# Altium schematic sheet Regulators.SchDoc: Power: Regulators
size A4; Engineer: Samer Kilani; DocumentNumber: 8; SheetNumber: 8; SheetTotal: 9
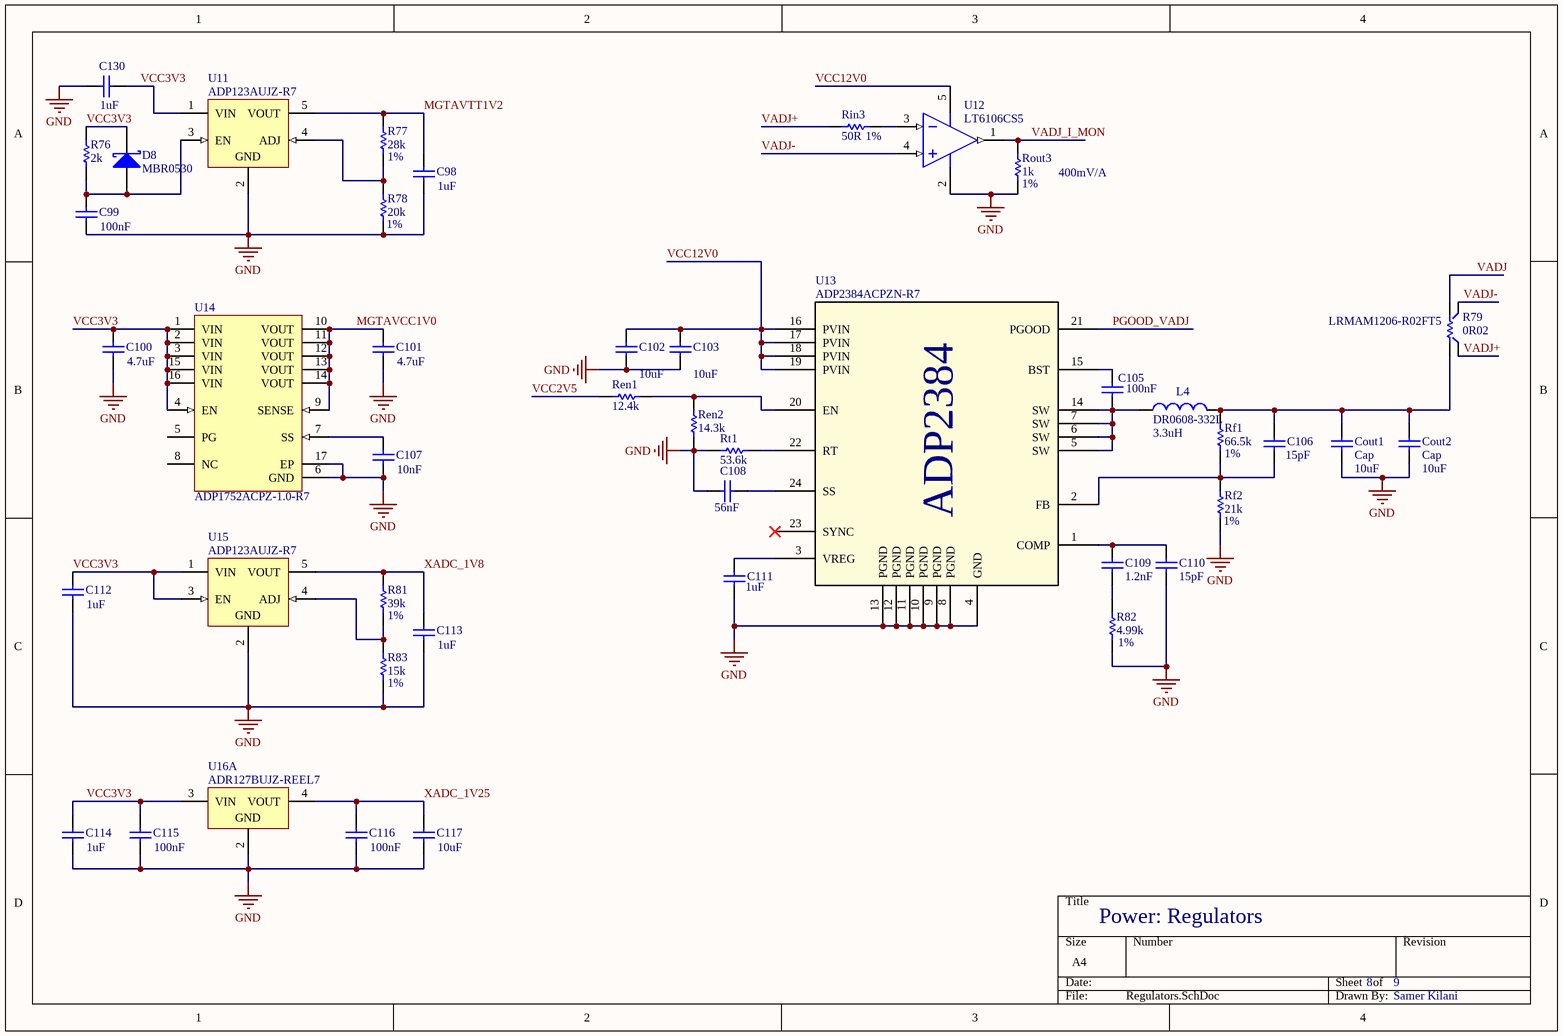
[diagram p0: Regulators.SchDoc]

## Parts
C98  value 1uF  [C0603]
C99  value 100nF  [C0402]
C100  value 4.7uF  [C0603]
C101  value 4.7uF  [C0603]
C102  value 10uF  [C0805]
C103  value 10uF  [C0805]
C105  value 100nF  [C0402]  (hidden comment: Cap)
C106  value 15pF  [C0402]
C107  value 10nF  [C0603]
C108  value 56nF  [C0402]
C109  value 1.2nF  [C0402]
C110  value 15pF  [C0402]
C111  value 1uF  [C0402]
C112  value 1uF  [C0603]
C113  value 1uF  [C0603]
C114  value 1uF  [C0603]
C115  value 100nF  [C0402]
C116  value 100nF  [C0402]
C117  value 10uF  [C0603]
C130  value 1uF  [C0603]
Cout1  Cap  value 10uF  [C0805]
Cout2  Cap  value 10uF  [C0805]
D8  MBR0530  [SOD-123]
L4  DR0608-332L  value 3.3uH  [DR0608]
R76  value 2k  [R0402]  (hidden comment: Res)
R77  value 28k  Tolerance: 1%  [R0402]  (hidden comment: Res)
R78  value 20k  Tolerance: 1%  [R0402]  (hidden comment: Res)
R79  LRMAM1206-R02FT5  value 0R02  [LRMA1206]  (net tie)
R81  value 39k  Tolerance: 1%  [R0603]  (hidden comment: Res)
R82  value 4.99k  Tolerance: 1%  [R0402]  (hidden comment: Res)
R83  value 15k  Tolerance: 1%  [R0603]  (hidden comment: Res)
Ren1  value 12.4k  [R0402]  (hidden comment: Res)
Ren2  value 14.3k  [R0402]  (hidden comment: Res)
Rf1  value 66.5k  Tolerance: 1%  [R0402]  (hidden comment: Res)
Rf2  value 21k  Tolerance: 1%  [R0402]  (hidden comment: Res)
Rin3  value 50R  Tolerance: 1%  [R0402]  (hidden comment: Res)
Rout3  value 1k  Tolerance: 1%  [R0402]  (hidden comment: Res)
Rt1  value 53.6k  [R0402]  (hidden comment: Res)
U11  ADP123AUJZ-R7  [ADI-UJ-5_N]
U12  LT6106CS5  [LT-S5-5-TSOT-23_N]
U13  ADP2384ACPZN-R7  [CP_24_12]
U14  ADP1752ACPZ-1.0-R7  [CP-16-4_N]
U15  ADP123AUJZ-R7  [ADI-UJ-5_N]
U16  ADR127BUJZ-REEL7  [ADI-UJ-6_N]  (part A of 2)

## Nets
GND: C98.2 C99.2 C100.2 C101.2 C102.2 C103.2 C107.2 C108.2 C110.2 C111.1 C112.2 C113.2 C114.2 C115.2 C116.2 C117.2 C130.1 Cout1.1 Cout2.1 R78.1 R82.1 R83.1 Ren2.1 Rf2.1 Rout3.1 Rt1.1 U11.2(GND) U12.2(V-) U13.4(GND) U13.8(PGND) U13.9(PGND) U13.10(PGND) U13.11(PGND) U13.12(PGND) U13.13(PGND) U14.6(GND) U14.17(EP) U15.2(GND) U16.2(GND)
MGTAVCC1V0: C101.1 U14.9(SENSE) U14.10(VOUT) U14.11(VOUT) U14.12(VOUT) U14.13(VOUT) U14.14(VOUT)
MGTAVTT1V2: C98.1 R77.2 U11.5(VOUT)
PGOOD_VADJ: U13.21(PGOOD)
VADJ: R79.2
VADJ+: R79.3 Rin3.1
VADJ-: R79.4 U12.4(+IN)
VADJ_I_MON: Rout3.2 U12.1(OUT)
VCC2V5: Ren1.1
VCC3V3: C100.1 C112.1 C114.1 C115.1 C130.2 D8.1(K) R76.2 U11.1(VIN) U14.1(VIN) U14.2(VIN) U14.3(VIN) U14.4(EN) U14.15(VIN) U14.16(VIN) U15.1(VIN) U15.3(EN) U16.3(VIN)
VCC12V0: C102.1 C103.1 U12.5(V+) U13.16(PVIN) U13.17(PVIN) U13.18(PVIN) U13.19(PVIN)
XADC_1V8: C113.1 R81.2 U15.5(VOUT)
XADC_1V25: C116.1 C117.1 U16.4(VOUT)
NetC99_1: C99.1 D8.2(A) R76.1 U11.3(EN)
NetC105_1: C105.1 L4.1 U13.5(SW) U13.6(SW) U13.7(SW) U13.14(SW)
NetC105_2: C105.2 U13.15(BST)
NetC106_1: C106.1 Cout1.2 Cout2.2 L4.2 R79.1 Rf1.2
NetC106_2: C106.2 Rf1.1 Rf2.2 U13.2(FB)
NetC107_1: C107.1 U14.7(SS)
NetC108_1: C108.1 U13.24(SS)
NetC109_1: C109.1 C110.1 U13.1(COMP)
NetC109_2: C109.2 R82.2
NetC111_2: C111.2 U13.3(VREG)
NetR77_1: R77.1 R78.2 U11.4(ADJ)
NetR81_1: R81.1 R83.2 U15.4(ADJ)
NetRen1_2: Ren1.2 Ren2.2 U13.20(EN)
NetRin3_2: Rin3.2 U12.3(-IN)
NetRt1_2: Rt1.2 U13.22(RT)

Not connected (* = marked no-connect by the designer): U13 23(SYNC)*; U14 5(PG) 8(NC)

## Notes on the sheet
- (near Rout3) 400mV/A
- (near U13) ADP2384

## Library data of the parts
C98-C103 C105-C117 C130 Cout1 Cout2 = Cap: Capacitor; Published: 8-Jun-2000; LatestRevisionDate: 17-Jul-2002; LatestRevisionNote: Re-released for DXP Platform.; PackageReference: RAD-0.3; Publisher: Altium Limited; PackageDescription: Radial Cap, Thru-Hole; 2 Leads; 0.3 in Pin Spacing
L4 = Inductor: Code_IEC: 1005; Published: 8-Jun-2000; LatestRevisionDate: 29-May-2009; LatestRevisionNote: IPC-7351 Footprint Added.; PackageReference: 0402-A; Publisher: Altium Limited; PackageDescription: Chip Inductor; Code_JEITA: 0402
R76-R78 R81-R83 Ren1 Ren2 Rf1 Rf2 Rin3 Rout3 Rt1 = Res: Resistor
R79 = Res_sense: Resistor
U11 U15 = ADP123AUJZ-R7: 300 mA, Low Quiescent Current, CMOS Linear Regulator, 2.3 to 5.5 V Vin, 0.8 to 5 V Vout, Industrial, 5-pin SOT23 (UJ-5), Reel; Manufacturer: Analog Devices; Iout max: 300mA; Supply Current IGND @ Small Load: 45uA; Vin (max) (V): 5.5; Vin (min) (V): 2.3; Vout Adjustable Range: 0.8V to 5V; DatasheetVersion: Rev. E; PackageVersion: 100708-A, 10/2008; PackageReference: UJ-5; PackageDescription: 5-Pin Thin Small Outline Transistor Package, Body 2.9 x 1.6 mm, Pitch 0.95 mm; Supplier 1: Digi-Key; Supplier Part Number 1: ADP123AUJZ-R7TR-ND; Supplier 2: Digi-Key; Supplier Part Number 2: ADP123AUJZ-R7CT-ND; Supplier 3: Digi-Key; Supplier Part Number 3: ADP123AUJZ-R7DKR-ND; Supplier 4: Farnell; Supplier Part Number 4: 2296039; Supplier 5: Newark; Supplier Part Number 5: 12T2968; Supplier 6: Newark; Supplier Part Number 6: 52R8082; Supplier 7: Mouser; Supplier Part Number 7: 584-ADP123AUJZ-R7; Packing: Reel; Mounting Technology: Surface Mount; Code_JEDEC: MO-193-AB; PartNumber: ADP123AUJZ-R7; ComponentLink1Description: Manufacturer URL; ComponentLink1URL: http://www.analog.com/en/index.html; ComponentLink2Description: Datasheet; ComponentLink2URL: http://www.analog.com/static/imported-files/data_sheets/ADP122_123.pdf; ComponentLink3Description: Package Specification; ComponentLink3URL: http:/www.analog.com/static/imported-files/packages/PKG_PDF/TSOT(UJ)/UJ_5.pdf; ComponentLink4Description: URL Link1; ComponentLink4URL: Product URL:http://www.analog.com/en/ADP123/productSearch.html
U12 = LT6106CS5: Single Channel, Low Cost, High Side Current Sense Operational Amplifier, 0.2 MHz Typical GBW, 5-Pin SOT-23 (S5-5), Commercial; Linear Technology Part Number: LT6106; Manufacturer: Linear Technology; Channels (#): 1; GBW (MHz) Typical: 0.2; Is (mA) Typical: 0.06; Vos (mV) Guaranteed: 0.25; Vos (mV) Typical: 0.15; Vs Max (V): 36; Vs Min (V): 2.7; DatasheetVersion: Rev. A; PackageReference: LT-S5-5-TSOT-23; PackageDescription: 5-Lead Plastic TSOT-23, Body 1.63 x 2.90 mm, Pitch 0.95 mm; Type: CSA; Mounting Technology: Surface Mount; Code_JEDEC: MO-193; PartNumber: LT6106CS5; ComponentLink1Description: Manufacturer URL; ComponentLink1URL: http://www.linear.com/; ComponentLink2Description: Datasheet; ComponentLink2URL: http://cds.linear.com/docs/en/datasheet/6106fa.pdf; ComponentLink3Description: Package Specification; ComponentLink3URL: http://cds.linear.com/docs/en/packaging/SOT_5_05-08-1635.pdf
U13 = ADP2384ACPZN-R7: Imported; Value: Value; Type: Type; RefDes: RefDes
U14 = ADP1752ACPZ-1.0-R7: 0.8 A, Low VIN, Low Dropout Linear Regulator, 1.6 to 3.6 V Vin, 1 V Vout, Industrial, 16-pin QFN (CP-16-4), Reel; Manufacturer: Analog Devices; Iout max: 800mA; Preset Vout Values (V): 1; Supply Current IGND @ Small Load: 90uA; Vin (max) (V): 3.6; Vin (min) (V): 1.6; DatasheetVersion: Rev. D; PackageVersion: 010606-0, 01/2006; PackageReference: CP-16-4; PackageDescription: 16-Pin Lead Frame Chip Scale Package, Body 4 x 4 mm, Pitch 0.65 mm; Supplier 1: Digi-Key; Supplier Part Number 1: ADP1752ACPZ-1.0-R7TR-ND; Supplier 2: Digi-Key; Supplier Part Number 2: ADP1752ACPZ-1.0-R7CT-ND; Supplier 3: Digi-Key; Supplier Part Number 3: ADP1752ACPZ-1.0-R7DKR-ND; Supplier 4: Mouser; Supplier Part Number 4: 584-ADP1752ACPZ1.0R7; Packing: Reel; Mounting Technology: Surface Mount; Code_JEDEC: MO-220-VGGC; PartNumber: ADP1752ACPZ-1.0-R7; ComponentLink1Description: Manufacturer URL; ComponentLink1URL: http://www.analog.com/en/index.html; ComponentLink2Description: Datasheet; ComponentLink2URL: http://www.analog.com/static/imported-files/data_sheets/ADP1752_1753.pdf; ComponentLink3Description: Package Specification; ComponentLink3URL: http://www.analog.com/static/imported-files/packages/46009454504174339653421710019CP_16_4.pdf; ComponentLink4Description: URL Link1; ComponentLink4URL: Product URL:http://www.analog.com/en/ADP1752/productSearch.html
U16 = ADR127BUJZ-REEL7: Precision, Micropower LDO Voltage Reference in TSOT, 1.25 V Output, 2.7 to 18 V Supply, Industrial, 6-pin SOT23 (UJ-6), Reel; Manufacturer: Analog Devices; Max V Supply (V): 18; Min V Supply (V): 2.7; Ref Out TC (ppm/C): 3; Vout: 1.25V; DatasheetVersion: Rev. B; PackageVersion: Dec-04; PackageReference: UJ-6; PackageDescription: 6-Pin Thin Small Outline Transistor Package, Body 2.9 x 1.6 mm, Pitch 0.95 mm; Supplier 1: Digi-Key; Supplier Part Number 1: ADR127BUJZ-REEL7TR-ND; Supplier 2: Digi-Key; Supplier Part Number 2: ADR127BUJZ-REEL7CT-ND; Supplier 3: Digi-Key; Supplier Part Number 3: ADR127BUJZ-REEL7DKR-ND; Supplier 4: Farnell; Supplier Part Number 4: 2312969; Supplier 5: Mouser; Supplier Part Number 5: 584-ADR127BUJZ-R7; Packing: Reel; Operating Temp Range: -40 to 125 degC; Mounting Technology: Surface Mount; Code_JEDEC: MO-193-AA; PartNumber: ADR127BUJZ-REEL7; ComponentLink1Description: Manufacturer URL; ComponentLink1URL: http://www.analog.com/en/index.html; ComponentLink2Description: Datasheet; ComponentLink2URL: http://www.analog.com/static/imported-files/data_sheets/ADR121_125_127.pdf; ComponentLink3Description: Package Specification; ComponentLink3URL: http://www.analog.com/static/imported-files/packages/PKG_PDF/TSOT(UJ)/UJ_6.pdf; ComponentLink4Description: URL Link1; ComponentLink4URL: Product URL:http://www.analog.com/en/special-linear-functions/voltage-references/adr127/products/product.html